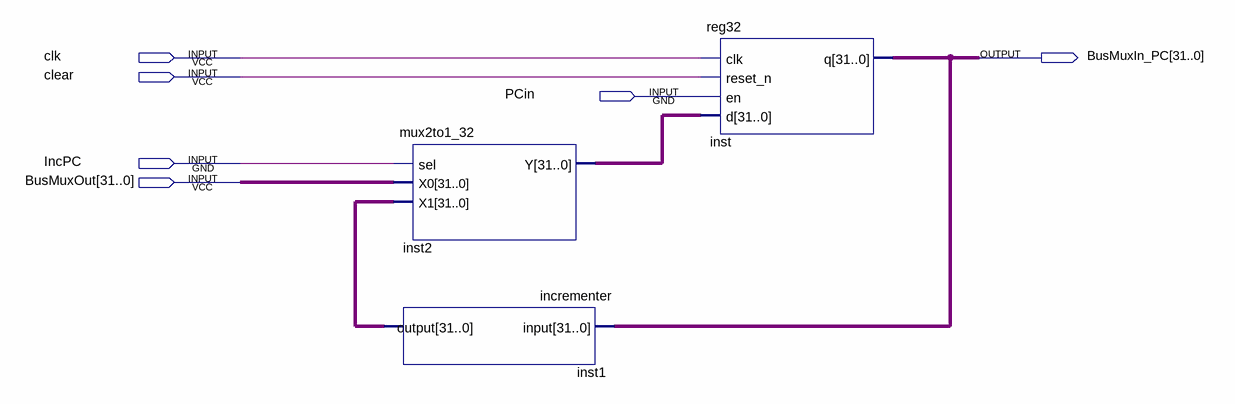
[diagram p0: schematic sheet]
// Quartus schematic pc_design.bdf as structural Verilog: 3 symbols, 6 pins
module pc_design (
  input  clk,
  input  clear,
  input  PCin,
  input  IncPC,
  input  [31:0] BusMuxOut,
  output [31:0] BusMuxIn_PC
);

  wire [31:0] inst1_output, inst2_y;

  incrementer inst1 (.\input (BusMuxIn_PC), .\output (inst1_output));
  mux2to1_32 inst2 (.sel(IncPC), .X0(BusMuxOut), .X1(inst1_output), .Y(inst2_y));
  reg32 inst (.clk(clk), .reset_n(clear), .en(PCin), .d(inst2_y), .q(BusMuxIn_PC));
endmodule
